# Altium schematic sheet ESP-MGMT 2.SchDoc: ESP-MGMT
size A; SheetNumber: 4; SheetTotal: 8
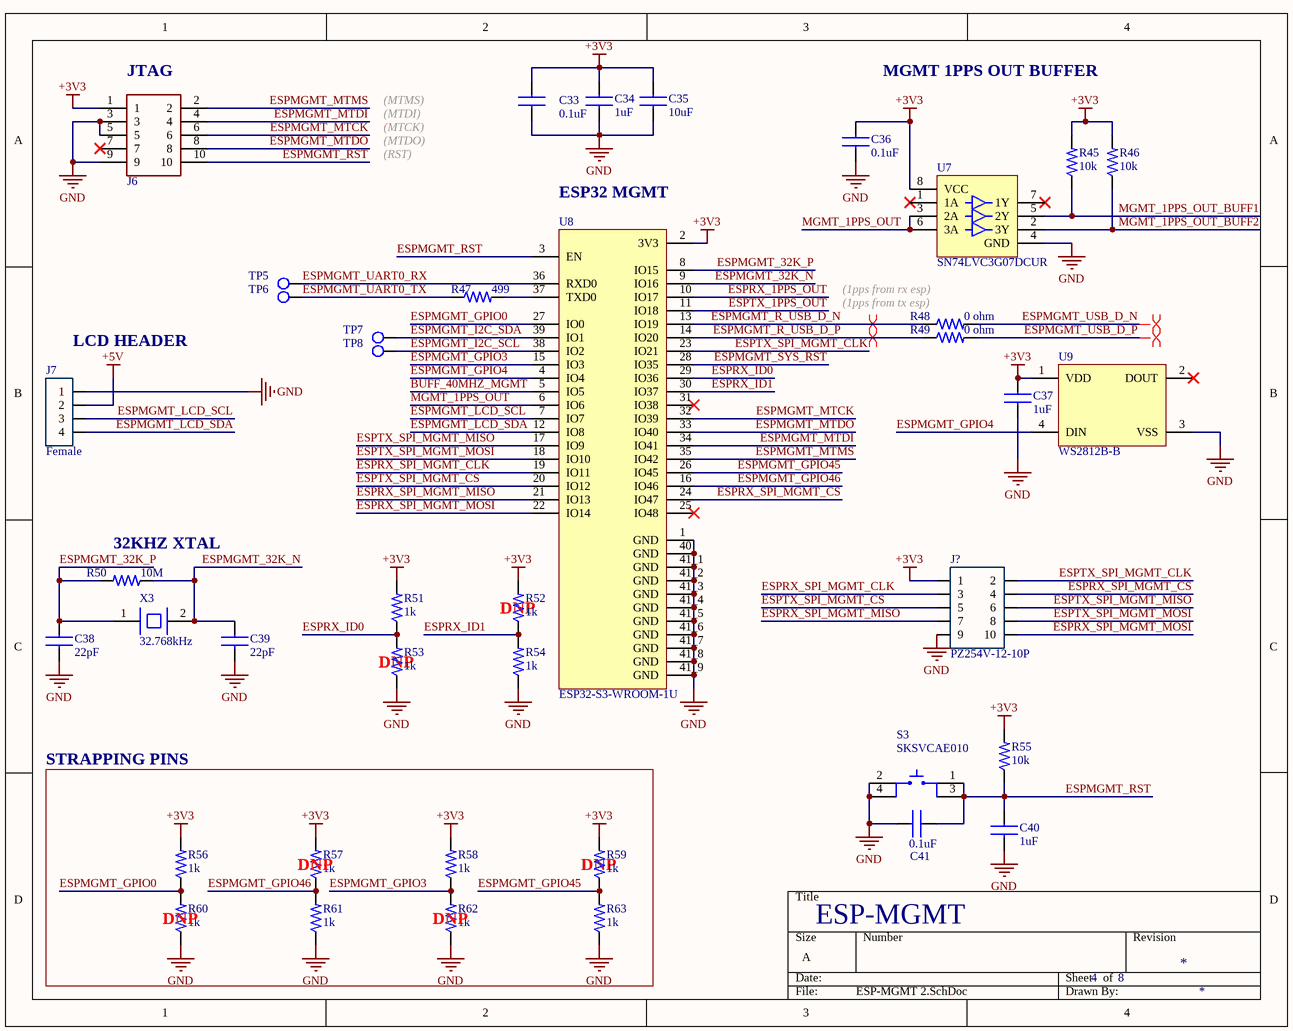
[diagram p0: ESP-MGMT 2.SchDoc]

## Parts
C33  0.1uF  [CAP_0402]
C34  1uF  [CAP_0402]
C35  10uF  [CAP_0402]
C36  0.1uF  [CAP_0402]
C37  1uF  [CAP_0402]
C38  22pF  [CAP_0402]
C39  22pF  [CAP_0402]
C40  1uF  [CAP_0402]
C41  0.1uF  [CAP_0402]
J6  CONN_TC2050-IDC  [CONN_TAG-CONNECT_TC2050-IDC]  (value not drawn)
J7  value Female  [CONN_4_PIN_100MIL]  (hidden comment: PPTC041LFBN-RC)
J?  PZ254V-12-10P  [CONN_10_PIN_100MIL]
R45  10k  [RES_0402]
R46  10k  [RES_0402]
R47  499  [RES_0402]
R48  0 ohm  [RES_0402]
R49  0 ohm  [RES_0402]
R50  10M  [RES_0402]
R51  1k  [RES_0402]
R52  1k  [RES_0402]
R53  1k  [RES_0402]
R54  1k  [RES_0402]
R55  10k  [RES_0402]
R56  1k  [RES_0402]
R57  1k  [RES_0402]
R58  1k  [RES_0402]
R59  1k  [RES_0402]
R60  1k  [RES_0402]
R61  1k  [RES_0402]
R62  1k  [RES_0402]
R63  1k  [RES_0402]
S3  SKSVCAE010  [SW_SKSVCAE010]
TP5  Test Point 1MM  [TP_PAD-1MM]  (value not drawn)  (no BOM)
TP6  Test Point 1MM  [TP_PAD-1MM]  (value not drawn)  (no BOM)
TP7  Test Point 1MM  [TP_PAD-1MM]  (value not drawn)  (no BOM)
TP8  Test Point 1MM  [TP_PAD-1MM]  (value not drawn)  (no BOM)
U7  SN74LVC3G07DCUR  [IC_SN74LVC3G07DCUR]
U8  ESP32-S3-WROOM-1U  [IC_ESP32-S3-WROOM-1U]
U9  WS2812B-B  [LED_WS2812B-B]
X3  32.768kHz  [XTAL_X321532768KGD2SI]

## Nets
+3V3: C33.2 C34.2 C35.2 C36.2 C37.2 J6.1 J?.1 R45.2 R46.2 R51.2 R52.2 R55.2 R56.2 R57.2 R58.2 R59.2 U7.8(VCC) U8.2(3V3) U9.1(VDD)
+5V: J7.2
GND: C33.1 C34.1 C35.1 C36.1 C37.1 C38.1 C39.1 C40.1 C41.1 J6.3 J6.5 J6.9 J7.1 J?.9 R53.1 R54.1 R60.1 R61.1 R62.1 R63.1 S3.2 S3.4 U7.4(GND) U8.1(GND) U8.40(GND) U8.41_1(GND) U8.41_2(GND) U8.41_3(GND) U8.41_4(GND) U8.41_5(GND) U8.41_6(GND) U8.41_7(GND) U8.41_8(GND) U8.41_9(GND) U9.3(VSS)
BUFF_40MHZ_MGMT: U8.5(IO5)
ESPMGMT_32K_N: C39.2 R50.1 U8.9(IO16) X3.2(GND)
ESPMGMT_32K_P: C38.2 R50.2 U8.8(IO15) X3.1(IN/OUT)
ESPMGMT_GPIO0: R56.1 R60.2 U8.27(IO0)
ESPMGMT_GPIO3: R58.1 R62.2 U8.15(IO3)
ESPMGMT_GPIO4: U8.4(IO4) U9.4(DIN)
ESPMGMT_GPIO45: R59.1 R63.2 U8.26(IO45)
ESPMGMT_GPIO46: R57.1 R61.2 U8.16(IO46)
ESPMGMT_I2C_SCL: TP8.1 U8.38(IO2)
ESPMGMT_I2C_SDA: TP7.1 U8.39(IO1)
ESPMGMT_LCD_SCL: J7.3 U8.7(IO7)
ESPMGMT_LCD_SDA: J7.4 U8.12(IO8)
ESPMGMT_MTCK: J6.6 U8.32(IO39)
ESPMGMT_MTDI: J6.4 U8.34(IO41)
ESPMGMT_MTDO: J6.8 U8.33(IO40)
ESPMGMT_MTMS: J6.2 U8.35(IO42)
ESPMGMT_R_USB_D_N: R48.1 U8.13(IO19)
ESPMGMT_R_USB_D_P: R49.1 U8.14(IO20)
ESPMGMT_RST: C40.2 C41.2 J6.10 R55.1 S3.1 S3.3 U8.3(EN)
ESPMGMT_SYS_RST: U8.28(IO35)
ESPMGMT_UART0_RX: TP5.1 U8.36(RXD0)
ESPMGMT_UART0_TX: R47.1 TP6.1
ESPMGMT_USB_D_N: R48.2
ESPMGMT_USB_D_P: R49.2
ESPRX_1PPS_OUT: U8.10(IO17)
ESPRX_ID0: R51.1 R53.2 U8.29(IO36)
ESPRX_ID1: R52.1 R54.2 U8.30(IO37)
ESPRX_SPI_MGMT_CLK: J?.3 U8.19(IO11)
ESPRX_SPI_MGMT_CS: J?.4 U8.24(IO47)
ESPRX_SPI_MGMT_MISO: J?.7 U8.21(IO13)
ESPRX_SPI_MGMT_MOSI: J?.10 U8.22(IO14)
ESPTX_1PPS_OUT: U8.11(IO18)
ESPTX_SPI_MGMT_CLK: J?.2 U8.23(IO21)
ESPTX_SPI_MGMT_CS: J?.5 U8.20(IO12)
ESPTX_SPI_MGMT_MISO: J?.6 U8.17(IO9)
ESPTX_SPI_MGMT_MOSI: J?.8 U8.18(IO10)
MGMT_1PPS_OUT: U7.3(2A) U7.6(3A) U8.6(IO6)
MGMT_1PPS_OUT_BUFF1: R45.1 U7.5(2Y)
MGMT_1PPS_OUT_BUFF2: R46.1 U7.2(3Y)
NetR47_2: R47.2 U8.37(TXD0)

Not connected (* = marked no-connect by the designer): J6 7*; U7 1(1A)* 7(1Y)*; U8 25(IO48)* 31(IO38)*; U9 2(DOUT)*

## Layout directives
differential pair: ESPMGMT_R_USB_D_N, ESPMGMT_R_USB_D_P, ESPMGMT_USB_D_N, ESPMGMT_USB_D_P

## Notes on the sheet
- (near J6) JTAG
- (MTMS)
- MGMT 1PPS OUT BUFFER
- (MTDI)
- (MTCK)
- (MTDO)
- (RST)
- (near U8) ESP32 MGMT
- (near R48) (1pps from tx esp)
- (1pps from rx esp)
- (near J7) LCD HEADER
- (near R50) 32KHZ XTAL
- (near R52) DNP
- (near R53) DNP
- STRAPPING PINS
- (near R60) DNP
- (near R57) DNP
- (near R62) DNP
- (near R59) DNP

## Library data of the parts
C33 C36 C41 = CAP_GCM155R71C104KA55J: Cap Ceramic 0.1uF 16V X7R 10% SMD 0402 125C Paper T/R; Manufacturer: Murata; Capacitance: 100nF; Supplier 1: Digi-Key; Manufacturer Part Number: GCM155R71C104KA55J; RoHS: Yes; Category: Ceramic Capacitors; Stock 1: 10738061; Pricing 1: 1=0.10000, 10=0.03500, 50=0.01920, 100=0.01560, 500=0.01116, 1000=0.00877, 2500=0.00798, 5000=0.00734 (USD); Mount: Surface Mount; Case/Package: 0402; Case Code (Imperial): 0402; Case Code (Metric): 1005; Min Operating Temperature: -55°C; Max Operating Temperature: 125°C; Tolerance: 10%; Voltage Rating: 16V; Voltage Rating (DC): 16V; Packaging: Tape and Reel; Package Quantity: 1; Dielectric: X7R; Termination: SMD/SMT; Series: GCM; Construction: Flat; Length: 1mm; Width: 0.5mm; Height: 0.5mm; Thickness: 0.022inch; Depth: 0.5mm; Ratings: AEC-Q200; Radiation Hardening: No; Lead Free: Lead Free; ComponentLink1URL: https://datasheet.ciiva.com/11618/product-11618848.pdf?src-supplier=Avnet; ComponentLink1Description: https://datasheet.ciiva.com/11618/product-11618848.pdf?src-supplier=Avnet; ComponentLink2URL: https://datasheet.ciiva.com/16440/gcm155r71c104ka55j-16440393.pdf?src-supplier=Future+Electronics; ComponentLink2Description: https://datasheet.ciiva.com/16440/gcm155r71c104ka55j-16440393.pdf?src-supplier=Future+Electronics; ComponentLink3URL: https://datasheet.ciiva.com/29542/product-29542474.pdf?src-supplier=Digi-Key; ComponentLink3Description: https://datasheet.ciiva.com/29542/product-29542474.pdf?src-supplier=Digi-Key; ComponentLink4URL: https://datasheet.ciiva.com/29542/product-29542475.pdf?src-supplier=Digi-Key; ComponentLink4Description: https://datasheet.ciiva.com/29542/product-29542475.pdf?src-supplier=Digi-Key; Supplier Part Number 1: 490-7998-1-ND
C34 C37 C40 = CAP_CL05A105KA5NQNC: Cap Ceramic 1uF 25V X5R 10% SMD 0402 85°C Cardboard T/R; Manufacturer: Samsung; Supplier 1: Digi-Key; Manufacturer Part Number: CL05A105KA5NQNC; RoHS: Yes; Category: Ceramic Capacitors; Pricing 1: 1=0.21000, 10=0.14900, 50=0.08460, 100=0.07000, 500=0.04910, 1000=0.04065, 2500=0.03784, 5000=0.03462 (USD); Mount: Surface Mount; Case/Package: 0402; Case Code (Metric): 1005; Case Code (Imperial): 0402; Material: Ceramic; Min Operating Temperature: -55°C; Max Operating Temperature: 85°C; Tolerance: 10%; Capacitance: 1uF; Voltage Rating: 25V; Packaging: Tape and Reel; Package Quantity: 10000; Dielectric: X5R; Series: CL; Construction: Flat; Length: 1mm; Width: 0.02inch; Height: 0.5mm; Depth: 0.5mm; Thickness: 0.022inch; Radiation Hardening: No; Lead Free: Lead Free; RoHS Compliant: Yes; ComponentLink1URL: https://datasheet.ciiva.com/3777/cl05a105ka5nqnc-3777709.pdf?src-supplier=Arrow+Electronics; ComponentLink1Description: https://datasheet.ciiva.com/3777/cl05a105ka5nqnc-3777709.pdf?src-supplier=Arrow+Electronics; ComponentLink2URL: https://datasheet.ciiva.com/25720/cl05a105ka5nqnc-25720771.pdf?src-supplier=Digi-Key; ComponentLink2Description: https://datasheet.ciiva.com/25720/cl05a105ka5nqnc-25720771.pdf?src-supplier=Digi-Key; ComponentLink3URL: https://datasheet.ciiva.com/29198/459147-da-01-en-vs-kondensator-0402-29198339.pdf?src-supplier=Conrad; ComponentLink3Description: https://datasheet.ciiva.com/29198/459147-da-01-en-vs-kondensator-0402-29198339.pdf?src-supplier=Conrad; Supplier Part Number 1: 1276-1445-6-ND
C35 = CAP_CL05A106MQ5NUNC: Cap Ceramic 10uF 6.3V X5R 20% SMD 0402 85°C Paper T/R; Manufacturer: Samsung; Supplier 1: Digi-Key; Manufacturer Part Number: CL05A106MQ5NUNC; RoHS: Yes; Category: Ceramic Capacitors; Stock 1: 3345553; Pricing 1: 1=0.27000, 10=0.18400, 50=0.11020, 100=0.09300, 500=0.06362, 1000=0.05629, 2500=0.05384, 5000=0.04894 (USD); Mount: Surface Mount; Case/Package: 0402; Case Code (Metric): 1005; Case Code (Imperial): 0402; Min Operating Temperature: -55°C; Max Operating Temperature: 85°C; Tolerance: 20%; Capacitance: 10uF; Dielectric: X5R; Packaging: Tape and Reel; Package Quantity: 1; Voltage Rating: 6.3V; Series: CL; Construction: Flat; Length: 1mm; Width: 0.02inch; Height: 0.5mm; Thickness: 0.028inch; Depth: 0.5mm; Radiation Hardening: No; ComponentLink1URL: https://datasheet.ciiva.com/16437/cl05a106mq5nunc-16437356.pdf?src-supplier=Future+Electronics; ComponentLink1Description: https://datasheet.ciiva.com/16437/cl05a106mq5nunc-16437356.pdf?src-supplier=Future+Electronics; ComponentLink2URL: https://datasheet.ciiva.com/26877/getdatasheetpartid-355289-26877841.pdf?src-supplier=Verical; ComponentLink2Description: https://datasheet.ciiva.com/26877/getdatasheetpartid-355289-26877841.pdf?src-supplier=Verical; Supplier Part Number 1: 1276-1451-1-ND
C38 C39 = CAP_CC0402JRNPO9BN220: 0402 22 pF 50 V ±5 % Tolerance NP0 SMT Multilayer Ceramic Capacitor; Manufacturer: Yageo; Tolerance: 5%; Dielectric: C0G; Voltage Rating (DC): 50V; Temperature Coefficient: 30ppm/°C; Insulation Resistance: 100GR; Supplier 1: Digi-Key; Manufacturer Part Number: CC0402JRNPO9BN220; RoHS: Yes; Category: Ceramic Capacitors; Stock 1: 1052; Pricing 1: 1=0.10000, 10=0.02200, 50=0.01180, 100=0.00960, 500=0.00688, 1000=0.00541, 2500=0.00492, 5000=0.00452 (USD); Mount: Surface Mount; Case/Package: 0402; Number of Pins: 2; Dielectric Material: Ceramic; Case Code (Metric): 1005; Case Code (Imperial): 0402; Min Operating Temperature: -55°C; Max Operating Temperature: 125°C; Capacitance: 22pF; Voltage: 50V; Series: CC; Voltage Rating: 50V; Packaging: Tape and Reel; Package Quantity: 1; Termination: SMD/SMT; Resistor Type: Ceramic; Length: 1mm; Width: 0.02inch; Height: 0.5mm; Depth: 0.5mm; Thickness: 0.022inch; Radiation Hardening: No; REACH SVHC: No SVHC; Lead Free: Lead Free; RoHS Compliant: Yes; ComponentLink1URL: https://datasheet.ciiva.com/143/mlccorderingcode-143986.pdf?src-supplier=Digi-Key; ComponentLink1Description: https://datasheet.ciiva.com/143/mlccorderingcode-143986.pdf?src-supplier=Digi-Key; ComponentLink2URL: https://datasheet.ciiva.com/143/mlccorderingcode-143987.pdf?src-supplier=Digi-Key; ComponentLink2Description: https://datasheet.ciiva.com/143/mlccorderingcode-143987.pdf?src-supplier=Digi-Key; ComponentLink3URL: https://datasheet.ciiva.com/143/mlccorderingcode-143988.pdf?src-supplier=Digi-Key; ComponentLink3Description: https://datasheet.ciiva.com/143/mlccorderingcode-143988.pdf?src-supplier=Digi-Key; ComponentLink4URL: https://datasheet.ciiva.com/5789/1443161-5789509.pdf?src-supplier=Farnell; ComponentLink4Description: https://datasheet.ciiva.com/5789/1443161-5789509.pdf?src-supplier=Farnell; ComponentLink5URL: https://datasheet.ciiva.com/5425/upy-gp-np0-16v-to-50v-8-5425483.pdf?src-supplier=Mouser; ComponentLink5Description: https://datasheet.ciiva.com/5425/upy-gp-np0-16v-to-50v-8-5425483.pdf?src-supplier=Mouser; ComponentLink6URL: https://datasheet.ciiva.com/15189/getdatasheetpartid-370074-15189117.pdf?src-supplier=Verical; ComponentLink6Description: https://datasheet.ciiva.com/15189/getdatasheetpartid-370074-15189117.pdf?src-supplier=Verical; ComponentLink7URL: https://datasheet.ciiva.com/7656/1132289-7656615.pdf?src-supplier=Element14; ComponentLink7Description: https://datasheet.ciiva.com/7656/1132289-7656615.pdf?src-supplier=Element14; ComponentLink8URL: https://datasheet.ciiva.com/16625/upy-gp-np0-16v-to-50v-8-16625509.pdf?src-supplier=Avnet+Europe; ComponentLink8Description: https://datasheet.ciiva.com/16625/upy-gp-np0-16v-to-50v-8-16625509.pdf?src-supplier=Avnet+Europe; ComponentLink9URL: https://datasheet.ciiva.com/8033/1443161-8033605.pdf?src-supplier=Element14; ComponentLink9Description: https://datasheet.ciiva.com/8033/1443161-8033605.pdf?src-supplier=Element14; ComponentLink10URL: https://datasheet.ciiva.com/8033/1443161-8033606.pdf?src-supplier=Element14; ComponentLink10Description: https://datasheet.ciiva.com/8033/1443161-8033606.pdf?src-supplier=Element14; ComponentLink11URL: https://datasheet.ciiva.com/8033/1443161-8033607.pdf?src-supplier=Element14; ComponentLink11Description: https://datasheet.ciiva.com/8033/1443161-8033607.pdf?src-supplier=Element14; Supplier Part Number 1: 311-1018-1-ND
J6 = CONN_TC2050-IDC: Cbl Plug-Of-Nails 10-Pin w/Legs; MF: {'manufacturer': u'Tag-Connect LLC'}; Availability: Unavailable; Price: None; Value: *; MP: TC2050-IDC; Package: None
J7 = CONN_4_PIN_FEMALE: 4 Position Header Connector 0.100" (2.54mm) Through Hole Tin; Digikey Link: https://www.digikey.com/product-detail/en/PPTC061LFBN-RC/S7004-ND/810145/?itemSeq=304982353; Digikey Part: S7004-ND; LCSC Part#: DNP
J? = CONN_10_PIN_MALE_PZ254V-12-10P: 双排排针 间距2.54mm 10pin 直插; Manufacturer: XFCN; Supplier 1: LCSC; Manufacturer Part Number: PZ254V-12-10P; RoHS: No; Stock 1: 26650; Pricing 1: 10=0.0491, 100=0.0405, 300=0.0362, 1000=0.0308, 5000=0.0283, 10000=0.027 (USD); Supplier Part Number 1: C492422
R45 R46 R55 = RES_AC0402FR-0710KL: RES SMD 10K OHM 1% 1/16W 0402; Manufacturer: Yageo; Resistance: 10kR; Power Rating: 62.5mW; Voltage Rating: 50V; Temperature Coefficient: 100ppm/°C; Max Power Dissipation: 63mW; Supplier 1: Digi-Key; Manufacturer Part Number: AC0402FR-0710KL; RoHS: Yes; Category: Chip SMD Resistors; Stock 1: 2860; Pricing 1: 1=0.10000, 10=0.02200, 100=0.00900, 1000=0.00402, 2500=0.00349, 5000=0.00288 (USD); Case/Package: 0402; Case Code (Imperial): 0402; Case Code (Metric): 1005; Size Code: 0402; Min Operating Temperature: -55°C; Max Operating Temperature: 155°C; Tolerance: 1%; Packaging: Tape and Reel; Resistor Type: Thick Film; Termination: SMD/SMT; Number of Terminations: 2; Features: Moisture Resistant,Automotive AEC-Q200; Series: AC; Construction: Rectangular; Length: 0.039inch; Width: 0.02inch; Height: 0.015inch; Depth: 0.5mm; Military Standard: Not; Lead Free: Lead Free; RoHS Compliant: Yes; ComponentLink1URL: https://datasheet.ciiva.com/12656/pyu-ac-51-rohs-l-2-12656634.pdf?src-supplier=Mouser; ComponentLink1Description: https://datasheet.ciiva.com/12656/pyu-ac-51-rohs-l-2-12656634.pdf?src-supplier=Mouser; Supplier Part Number 1: YAG3436CT-ND
R47 = RES_RC0402FR-07499RL: Res General Purpose Thick Film 0402 499 Ohm 1% 1/16W ±100ppm/°C Molded SMD Paper T/R; Manufacturer: Yageo; Value: 499R; Power Rating: 62.5mW; Voltage Rating: 50V; Max Power Dissipation: 63mW; Supplier 1: Digi-Key; Manufacturer Part Number: RC0402FR-07499RL; RoHS: Yes; Category: Chip SMD Resistors; Stock 1: 3392494; Pricing 1: 1=0.1, 10=0.015, 50=0.009, 100=0.0074, 500=0.00492, 1000=0.00421, 5000=0.003 (USD); Case/Package: 0402; Case Code (Metric): 1005; Case Code (Imperial): 0402; Min Operating Temperature: -55°C; Max Operating Temperature: 155°C; Tolerance: 1%; Package Quantity: 1; Packaging: Tape and Reel; Resistor Type: Thick Film; Number of Terminations: 2; Termination: SMD/SMT; Temperature Coefficient: 100ppm/°C; Voltage Rating (DC): 50V; Features: Moisture Resistant; Series: RC; Resistance Tolerance: 1%; Construction: Rectangular; Length: 0.039inch; Width: 0.02inch; Height: 0.016inch; Depth: 0.5mm; RoHS Compliant: Yes; Reach SVHC Compliant: No; Military Standard: Not; Lead Free: Lead Free; ComponentLink1URL: https://datasheet.ciiva.com/2453/pyu-r-int-thick-7-2453539.pdf?src-supplier=Digi-Key; ComponentLink1Description: https://datasheet.ciiva.com/2453/pyu-r-int-thick-7-2453539.pdf?src-supplier=Digi-Key; ComponentLink2URL: https://datasheet.ciiva.com/2453/pyu-r-int-thick-7-2453540.pdf?src-supplier=Digi-Key; ComponentLink2Description: https://datasheet.ciiva.com/2453/pyu-r-int-thick-7-2453540.pdf?src-supplier=Digi-Key; ComponentLink3URL: https://datasheet.ciiva.com/2453/pyu-r-int-thick-7-2453538.pdf?src-supplier=Digi-Key; ComponentLink3Description: https://datasheet.ciiva.com/2453/pyu-r-int-thick-7-2453538.pdf?src-supplier=Digi-Key; Supplier Part Number 1: 311-499LRCT-ND
R48 R49 = RES_RC0402JR-070RL: RES SMD 0 OHM JUMPER 1/16W 0402; Manufacturer: Yageo; Value: 0mR; Power Rating: 62.5mW; Tolerance: 5%; Voltage Rating: 50V; Max Power Dissipation: 63mW; Temperature Coefficient: 200ppm/°C; Supplier 1: Digi-Key; Manufacturer Part Number: RC0402JR-070RL; RoHS: Yes; Category: Chip SMD Resistors; Stock 1: 33185339; Pricing 1: 1=0.10000, 10=0.01200, 25=0.00840, 50=0.00640, 100=0.00480, 250=0.00364, 500=0.00290, 1000=0.00214, 5000=0.00154 (USD); Case/Package: 0402; Case Code (Metric): 1005; Case Code (Imperial): 0402; Contact Plating: Tin,Matte; Min Operating Temperature: -55°C; Max Operating Temperature: 155°C; Package Quantity: 1; Packaging: Tape and Reel; Resistor Type: Thick Film; Number of Terminations: 2; Termination: SMD/SMT; Features: Moisture Resistant; Series: RC; Technology: THICK FILM; Resistance Tolerance: 5%; Construction: Rectangular; Length: 1mm; Width: 0.02inch; Height: 0.016inch; Depth: 0.5mm; Radiation Hardening: No; Military Standard: Not; Lead Free: Lead Free; RoHS Compliant: Yes; ComponentLink1URL: https://datasheet.ciiva.com/2452/pyu-rc0402-51-rohs-l-6-2452608.pdf?src-supplier=Digi-Key; ComponentLink1Description: https://datasheet.ciiva.com/2452/pyu-rc0402-51-rohs-l-6-2452608.pdf?src-supplier=Digi-Key; ComponentLink2URL: https://datasheet.ciiva.com/7983/1018594-7983535.pdf?src-supplier=Element14; ComponentLink2Description: https://datasheet.ciiva.com/7983/1018594-7983535.pdf?src-supplier=Element14; ComponentLink3URL: https://datasheet.ciiva.com/22747/1018594-22747515.pdf?src-supplier=Element14; ComponentLink3Description: https://datasheet.ciiva.com/22747/1018594-22747515.pdf?src-supplier=Element14; ComponentLink4URL: https://datasheet.ciiva.com/2452/pyu-r-int-thick-7-2452609.pdf?src-supplier=Digi-Key; ComponentLink4Description: https://datasheet.ciiva.com/2452/pyu-r-int-thick-7-2452609.pdf?src-supplier=Digi-Key; ComponentLink5URL: https://datasheet.ciiva.com/2452/pyu-r-int-thick-7-2452610.pdf?src-supplier=Digi-Key; ComponentLink5Description: https://datasheet.ciiva.com/2452/pyu-r-int-thick-7-2452610.pdf?src-supplier=Digi-Key; ComponentLink6URL: https://datasheet.ciiva.com/8896/pyu-rc0402-51-rohs-l-6-8896201.pdf?src-supplier=Avnet; ComponentLink6Description: https://datasheet.ciiva.com/8896/pyu-rc0402-51-rohs-l-6-8896201.pdf?src-supplier=Avnet; ComponentLink7URL: https://datasheet.ciiva.com/15189/getdatasheetpartid-326379-15189533.pdf?src-supplier=Verical; ComponentLink7Description: https://datasheet.ciiva.com/15189/getdatasheetpartid-326379-15189533.pdf?src-supplier=Verical; Supplier Part Number 1: 311-0.0JRCT-ND
R50 = RES_CRGCQ0402J10M: Res Thick Film 0402 10M Ohm 5% 0.063W(1/16W) ±100ppm/C Pad SMD Automotive T/R; Manufacturer: TE Connectivity; Value: 10MR; Max Power Dissipation: 63mW; Temperature Coefficient: 100ppm/°C; Supplier 1: Digi-Key; Manufacturer Part Number: CRGCQ0402J10M; RoHS: Yes; Category: Chip SMD Resistors; Stock 1: 23325092; Pricing 1: 1=0.1, 10=0.018, 50=0.01, 100=0.0073, 500=0.00448, 1000=0.00329, 5000=0.00236 (USD); Case/Package: 0402; Min Operating Temperature: -55°C; Max Operating Temperature: 155°C; Features: Moisture Resistant,Automotive AEC-Q200; Tolerance: 5%; Number of Terminations: 2; Series: CRGCQ; Ratings: AEC-Q200; RoHS Compliant: Yes; ComponentLink1URL: https://www.te.com/commerce/DocumentDelivery/DDEController?Action=srchrtrv&amp;DocNm=1773204-3&amp;DocType=DS&amp;DocLang=English&src-supplier=Digi-Key; ComponentLink1Description: https://www.te.com/commerce/DocumentDelivery/DDEController?Action=srchrtrv&amp;DocNm=1773204-3&amp;DocType=DS&amp;DocLang=English&src-supplier=Digi-Key; Supplier Part Number 1: A130072CT-ND
R51-R54 R56-R63 = RES_RC0402JR-071KL: Res General Purpose Thick Film 0402 1K Ohm 5% 1/16W ±100ppm/°C Molded SMD Paper T/R; Manufacturer: Yageo; Resistance: 1kR; Power Rating: 62.5mW; Voltage Rating: 50V; Max Power Dissipation: 63mW; Supplier 1: Digi-Key; Manufacturer Part Number: RC0402JR-071KL; RoHS: Yes; Category: Chip SMD Resistors; Stock 1: 1442131; Pricing 1: 1=0.10000, 10=0.01300, 100=0.00540, 1000=0.00244, 2500=0.00212, 5000=0.00175 (USD); Case/Package: 0402; Case Code (Imperial): 0402; Case Code (Metric): 1005; Size Code: 0402; Min Operating Temperature: -55°C; Max Operating Temperature: 155°C; Tolerance: 5%; Packaging: Tape and Reel; Package Quantity: 1; Termination: SMD/SMT; Resistor Type: Thick Film; Number of Terminations: 2; Temperature Coefficient: 100ppm/°C; Features: Moisture Resistant; Series: RC; Resistance Tolerance: 5%; Construction: Rectangular; Length: 0.039inch; Width: 0.02inch; Height: 0.016inch; Depth: 0.5mm; REACH SVHC: No SVHC; Military Standard: Not; Lead Free: Lead Free; RoHS Compliant: Yes; ComponentLink1URL: https://datasheet.ciiva.com/2452/pyu-r-int-thick-7-2452755.pdf?src-supplier=Digi-Key; ComponentLink1Description: https://datasheet.ciiva.com/2452/pyu-r-int-thick-7-2452755.pdf?src-supplier=Digi-Key; ComponentLink2URL: https://datasheet.ciiva.com/2452/pyu-r-int-thick-7-2452756.pdf?src-supplier=Digi-Key; ComponentLink2Description: https://datasheet.ciiva.com/2452/pyu-r-int-thick-7-2452756.pdf?src-supplier=Digi-Key; ComponentLink3URL: https://datasheet.ciiva.com/2452/pyu-r-int-thick-7-2452757.pdf?src-supplier=Digi-Key; ComponentLink3Description: https://datasheet.ciiva.com/2452/pyu-r-int-thick-7-2452757.pdf?src-supplier=Digi-Key; ComponentLink4URL: https://datasheet.ciiva.com/17081/pyu-rc0402-51-rohs-l-6-r-17081438.pdf?src-supplier=Future+Electronics; ComponentLink4Description: https://datasheet.ciiva.com/17081/pyu-rc0402-51-rohs-l-6-r-17081438.pdf?src-supplier=Future+Electronics; ComponentLink5URL: https://datasheet.ciiva.com/7850/1018594-7850170.pdf?src-supplier=Element14; ComponentLink5Description: https://datasheet.ciiva.com/7850/1018594-7850170.pdf?src-supplier=Element14; ComponentLink6URL: https://datasheet.ciiva.com/7850/1018594-7850171.pdf?src-supplier=Element14; ComponentLink6Description: https://datasheet.ciiva.com/7850/1018594-7850171.pdf?src-supplier=Element14; ComponentLink7URL: https://datasheet.ciiva.com/7983/1018594-7983558.pdf?src-supplier=Element14; ComponentLink7Description: https://datasheet.ciiva.com/7983/1018594-7983558.pdf?src-supplier=Element14; Supplier Part Number 1: 311-1.0KJRCT-ND
S3 = SW_SKSVCAE010: 2.8x1.9mm Compact Type with Projection Surface Mount SKSV Series Tact Switch; Manufacturer: Alps Electric; Supplier 1: Mouser; Manufacturer Part Number: SKSVCAE010; RoHS: Yes; Category: Tactile Switches; Stock 1: 17441; Pricing 1: 1=0.54000, 10=0.54000, 50=0.43600, 100=0.42100, 1000=0.37500, 10000=0.36200 (USD); RoHS Compliant: Yes; ComponentLink1URL: http://www.mouser.com/ds/2/15/ALPS_SKSVCAE010-463040.pdf?src-supplier=Mouser; ComponentLink1Description: http://www.mouser.com/ds/2/15/ALPS_SKSVCAE010-463040.pdf?src-supplier=Mouser; Supplier Part Number 1: 688-SKSVCAE010
TP5-TP8 = TP_PAD-1MM
U7 = IC_SN74LVC3G07DCUR: Triple Buffer/Driver With Open-Drain Output, DCU0008A, LARGE T&R; Manufacturer: Texas Instruments; VCC(Max)(V): 5.5; Sub-Family: Non-Inverting Buffer/Driver; Logic: True; tpd @ Nom Voltage(Max)(ns): 8.3,4.8,4.2,3.4; Output Type: CMOS; F @ Nom Voltage(Max)(Mhz): 150; Technology Family: LVC; ICC @ Nom Voltage(Max)(mA): 0.01; Voltage(Nom)(V): 1.8,2.5,3.3,5; Schmitt Trigger: No; VCC(Min)(V): 1.65; Bits(#): 3; Input Type: CMOS/TTL; Rating: Catalog; Output Drive (IOL/IOH)(Max)(mA): 32/-32; Generic Part Number: SN74LVC3G07; PackageReference: DCU0008A; 3-State Output: No; DatasheetVersion: SCES365K; Operating Temperature Range(C): -40 to 125,-40 to 85; Manufacturer Part Number: SN74LVC3G07DCUR
U8 = IC_ESP32-S3-WROOM-1U: 2.4 GHz Wi-Fi (802.11 b/g/n) and Bluetooth 5 (LE) module; MF: Espressif Systems; Value: *; Package: Package; Check_prices: https://www.snapeda.com/parts/ESP32-S3-WROOM-1U/Espressif+Systems/view-part/?ref=eda; Price: None; MP: ESP32-S3-WROOM-1U; Availability: Not in stock; SnapEDA_Link: https://www.snapeda.com/parts/ESP32-S3-WROOM-1U/Espressif+Systems/view-part/?ref=snap; Supplier 1: Digi-Key; Supplier Part Number 1: 1965-ESP32-S3-WROOM-1U-N8R8CT-ND
U9 = LED_WS2812B-B: Intelligent control LED integrated light source; Manufacturer: WORLDSEMI; Manufacturer Part Number: WS2812B-B/W; Availability: Unavailable; Price: None; Package: None; MP: WS2812B-B; Value: *; Supplier 1: LCSC; RoHS: No; Category: Uncategorized; Stock 1: 70735; Pricing 1: 5=0.0923, 50=0.0756, 150=0.067, 1000=0.06, 2000=0.0575, 5000=0.0558 (USD); Supplier Part Number 1: C114586
X3 = XTAL_X321532768KGD2SI: 贴片无源晶振 32.768KHZ 12.5PF ±20ppm –40~+85 ℃; Manufacturer: YXC; Supplier 1: LCSC; Manufacturer Part Number: X321532768KGD2SI; RoHS: No; Supplier Part Number 1: C620155